# EAGLE design CrowPanel ESP32 Display-5.0-inch-V3.0-20240314  (EAGLE 9.6.2)
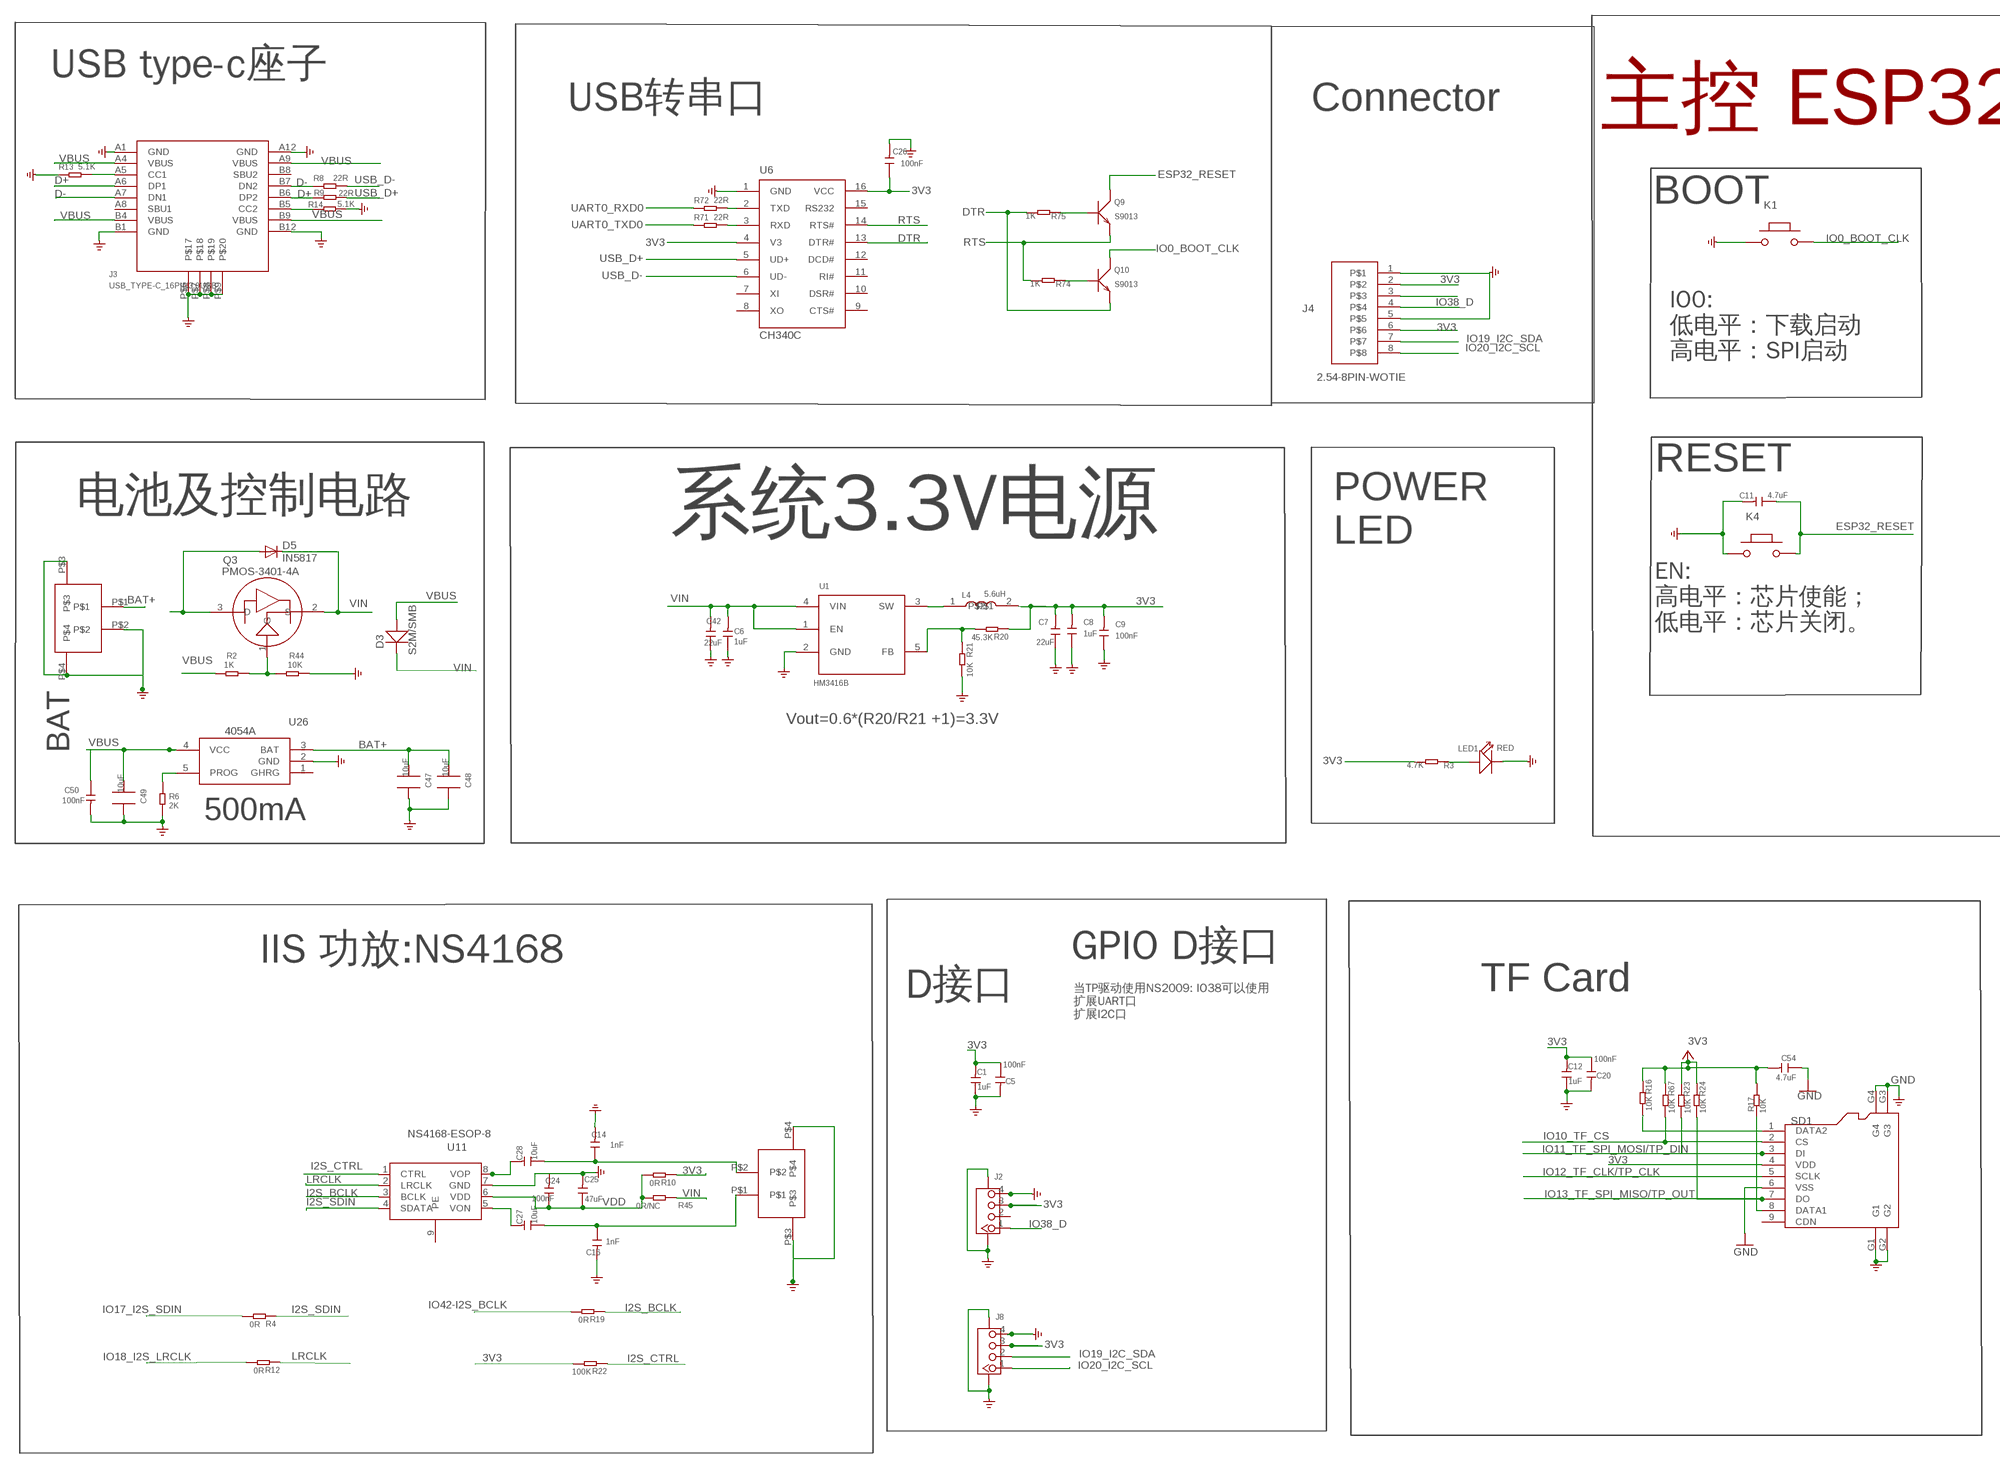
[diagram p0: schematic, sheet 1, part 1 of 2]
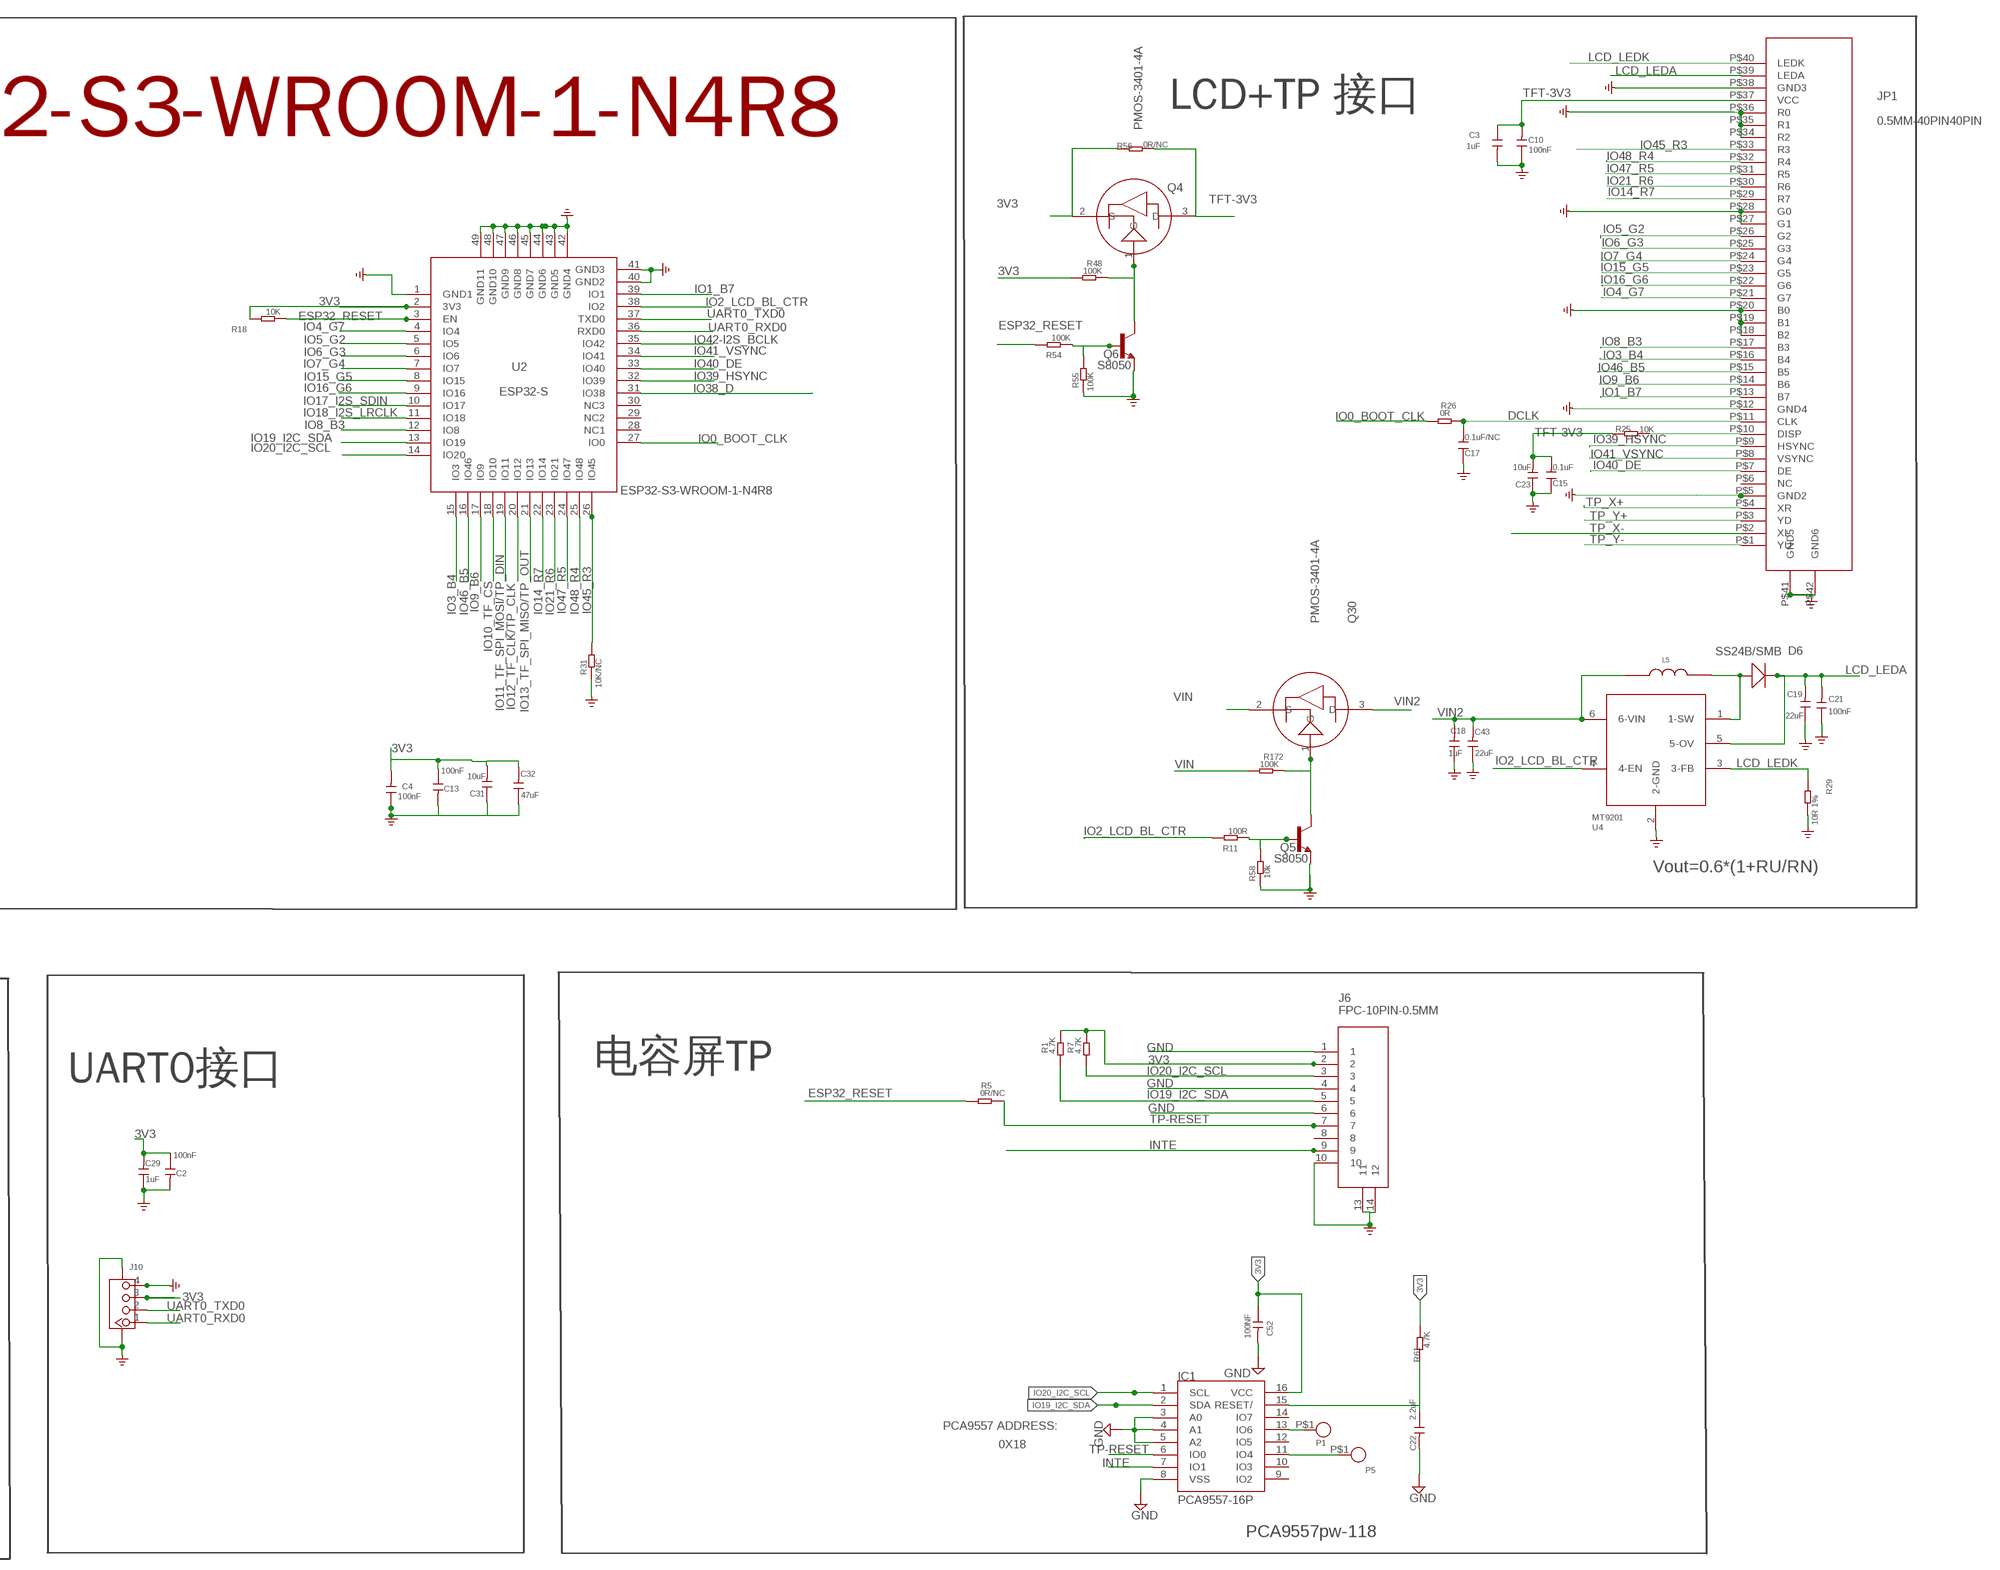
[diagram p1: schematic, sheet 1, part 2 of 2]

## Parts
C1  1uF  DISCRETE_C-0603  [DISCRETE_C0603]
C2  100nF  C-0603  [C0603]
C3  1uF  C-0603  [C0603]
C4  100nF  C-0603  [C0603]
C5  100nF  C-0603  [C0603]
C6  1uF  C0603  [0603]
C7  22uF  C0805  [0805]
C8  1uF  C0603  [0603]
C9  100nF  C0603  [0603]
C10  100nF  C-0603  [C0603]
C11  4.7uF  C0603  [0603]
C12  1uF  DISCRETE_C-0603  [DISCRETE_C0603]
C13  100nF  C-0603  [C0603]
C14  1nF  C-0603  [C0603]
C15  0.1uF  DISCRETE_C-0603  [DISCRETE_C0603]
C16  1nF  C-0603  [C0603]
C17  0.1uF/NC  DISCRETE_C-0603  [DISCRETE_C0603]
C18  1uF  C0603  [0603]
C19  22uF  C0805  [0805]
C20  100nF  C-0603  [C0603]
C21  100nF  C0603  [0603]
C22  2.2uF  C0603  [0603]
C23  10uF  DISCRETE_C-0603  [DISCRETE_C0603]
C24  100nF  C-0603  [C0603]
C25  47uF  C0805  [0805]
C26  100nF  C0603  [0603]
C27  10uF  DISCRETE_C-0603  [DISCRETE_C0603]
C28  10uF  DISCRETE_C-0603  [DISCRETE_C0603]
C29  1uF  DISCRETE_C-0603  [DISCRETE_C0603]
C31  10uF  DISCRETE_C-0603  [DISCRETE_C0603]
C32  47uF  C0805  [0805]
C42  22uF  C0805  [0805]
C43  22uF  C0805  [0805]
C47  10uF  C0805_S  [0805_S]
C48  10uF  C0805_S  [0805_S]
C49  10uF  C0805_S  [0805_S]
C50  100nF  C-0603  [C0603]
C52  100NF  A_XBJ_C0603  [A_XBJ_0603]
C54  4.7uF  DISCRETE_C-0603  [DISCRETE_C0603]
D3  S2M/SMB  214ABDO-214AB  [214AB]
D5  IN5817  DIODE-DO-214AC  [DO-214AC]
D6  SS24B/SMB  214ABDO-214AB  [214AB]
IC1  PCA9557-16P  [TSSOP16]
J1  PH2.0WT-2PIN  [PH2.0WT-2PIN]
J2  CONNECTOR_TWIG-4P-2.0-SMD-FEMALE-REINFORCE90D  [CONNECTOR_4P-SMD-2.0-90D]
J3  USB_TYPE-C_16PIN3.0USB  [KEVIN_3.0TYPEC-SMD]
J4  2.54-8PIN-WOTIE  [2.54-8P-WOTIE]
J5  PH2.0WT-2PIN  [PH2.0WT-2PIN]
J6  FPC-10PIN-0.5MM  [FPC-10PIN-0.5MM]
J8  CONNECTOR_TWIG-4P-2.0-SMD-FEMALE-REINFORCE90D  [CONNECTOR_4P-SMD-2.0-90D]
J10  CONNECTOR_TWIG-4P-2.0-SMD-FEMALE-REINFORCE90D  [CONNECTOR_4P-SMD-2.0-90D]
JP1  0.5MM-40PIN40PIN  [0.5MM*40P]
K1  BUTTON  PB157  [157SW]
K4  BUTTON  PB157  [157SW]
L4  5.6uH  L-0530  [CD54_CD54]
L5  CD32_6.8uH  CD32_950MA  [CD32]
LED1  RED  DISCRETE_LED0603  [DISCRETE_LED-0603]
P1  CROWPI_POW_PADPAD-1.0MM  [CROWPI_POW_PAD-1.0MM]
P5  CROWPI_POW_PADPAD-1.0MM  [CROWPI_POW_PAD-1.0MM]
Q3  PMOS-3401-4A  P-MOS-SOT23  [SOT-23]
Q4  PMOS-3401-4A  P-MOS-SOT23  [SOT-23]
Q5  S8050  SPARKFUN_TRANSISTOR_NPNSOT23  [SPARKFUN_SOT23]
Q6  S8050  SPARKFUN_TRANSISTOR_NPNSOT23  [SPARKFUN_SOT23]
Q9  S9013  TRANSISTOR-NPN-SOT23  [SOT23@1]
Q10  S9013  TRANSISTOR-NPN-SOT23  [SOT23@1]
Q30  PMOS-3401-4A  P-MOS-SOT23  [SOT-23]
R1  4.7K  R-0603  [R0603]
R2  1K  DISCRETE_R-0603  [DISCRETE_R0603]
R3  4.7K  DISCRETE_R-0603  [DISCRETE_R0603]
R4  0R  DISCRETE_R-0603  [DISCRETE_R0603]
R5  0R/NC  R-0603  [R0603]
R6  2K  DISCRETE_R-0603  [DISCRETE_R0603]
R7  4.7K  R-0603  [R0603]
R8  22R  DISCRETE_R-0603  [DISCRETE_R0603]
R9  22R  DISCRETE_R-0603  [DISCRETE_R0603]
R10  0R  DISCRETE_R-0603  [DISCRETE_R0603]
R11  100R  R0603  [R0603]
R12  0R  DISCRETE_R-0603  [DISCRETE_R0603]
R13  5.1K  DISCRETE_R-0603  [DISCRETE_R0603]
R14  5.1K  DISCRETE_R-0603  [DISCRETE_R0603]
R16  10K  DISCRETE_R-0603  [DISCRETE_R0603]
R17  10K  DISCRETE_R-0603  [DISCRETE_R0603]
R18  10K  DISCRETE_R-0603  [DISCRETE_R0603]
R19  0R  DISCRETE_R-0603  [DISCRETE_R0603]
R20  45.3K  DISCRETE_R-0603  [DISCRETE_R0603]
R21  10K  DISCRETE_R-0603  [DISCRETE_R0603]
R22  100K  DISCRETE_R-0603  [DISCRETE_R0603]
R23  10K  DISCRETE_R-0603  [DISCRETE_R0603]
R24  10K  DISCRETE_R-0603  [DISCRETE_R0603]
R25  10K  DISCRETE_R-0603  [DISCRETE_R0603]
R26  0R  R-0603  [R0603]
R29  10R 1%  DISCRETE_R-0603  [DISCRETE_R0603]
R31  10K/NC  R0603  [R0603]
R44  10K  DISCRETE_R-0603  [DISCRETE_R0603]
R45  0R/NC  DISCRETE_R-0603  [DISCRETE_R0603]
R48  100K  R-0603  [R0603]
R54  100K  R0603  [R0603]
R55  100K  R0603  [R0603]
R56  0R/NC  DISCRETE_R-0603  [DISCRETE_R0603]
R58  10k  R0603  [R0603]
R61  4.7K  DISCRETE_R-0603  [DISCRETE_R0603]
R67  10K  DISCRETE_R-0603  [DISCRETE_R0603]
R71  22R  DISCRETE_R-0603  [DISCRETE_R0603]
R72  22R  DISCRETE_R-0603  [DISCRETE_R0603]
R74  1K  DISCRETE_R-0603  [DISCRETE_R0603]
R75  1K  DISCRETE_R-0603  [DISCRETE_R0603]
R172  100K  R-0603  [R0603]
SD1  HOLDER-MICROSD-9P  [9P-SMD-W/-RING]
U1  HM3416B  A_XBJ_HM3420B  [A_XBJ_SOT23-5]
U2  ESP32-S  [ESP32-S3]
U4  MT9201  [SOT23-6]
U6  CH340C  CH340G  [SOP-16]
U11  NS4168-ESOP-8  [NS4168-ESOP-8]
U26  4054A  [SOP23-5]

## Nets
3V3: C1.2 C2.1 C4.2 C5.1 C7.2 C8.2 C9.2 C12.2 C13.1 C20.1 C26.1 C29.2 C31.2 C32.2 C52.1 C54.2 IC1.16(VCC) J2.3 J4.2 J4.6 J6.2 J8.3 J10.3 L4.2 Q4.2(S) R1.2 R3.2 R7.2 R10.1 R16.1 R17.1 R18.1 R20.1 R22.2 R23.1 R24.1 R48.1 R56.1 R61.2 R67.1 SD1.4(VDD) U2.2(3V3) U6.4(V3) U6.16(VCC) ; supply symbol labelled +3V3
BAT+: C47.2 C48.2 D5.A J1.P$1 Q3.3(D) U26.3(BAT)
D+: J3.A6(DP1) J3.B6(DP2) R9.1
D-: J3.A7(DN1) J3.B7(DN2) R8.1
DCLK: C17.2 JP1.P$11(CLK) R26.2
DTR: Q10.2(E) R75.2 U6.13(DTR#)
ESP32_RESET: C11.1 K4.2 Q9.3(C) R5.1 R18.2 R54.2 U2.3(EN)
GND: C1.1 C2.2 C3.2 C4.1 C5.2 C6.1 C7.1 C8.1 C9.1 C10.1 C11.2 C12.1 C13.2 C14.2 C15.1 C16.2 C17.1 C18.1 C19.1 C20.2 C21.1 C22.2 C23.1 C24.2 C25.2 C26.2 C29.1 C31.1 C32.1 C42.1 C43.1 C47.1 C48.1 C49.1 C50.2 C52.2 C54.1 IC1.3(A0) IC1.4(A1) IC1.5(A2) IC1.8(VSS) J1.P$2 J1.P$3 J1.P$4 J2.4 J2.SS1 J2.SS2 J3.A1(GND) J3.A12(GND) J3.B1(GND) J3.B12(GND) J3.P$6 J3.P$7 J3.P$8 J3.P$9 J4.1 J4.5 J5.P$3 J5.P$4 J6.1 J6.4 J6.6 J6.10 J6.13 J6.14 J8.4 J8.SS1 J8.SS2 J10.4 J10.SS1 J10.SS2 JP1.P$5(GND2) JP1.P$12(GND4) JP1.P$18(B2) JP1.P$19(B1) JP1.P$20(B0) JP1.P$27(G1) JP1.P$28(G0) JP1.P$34(R2) JP1.P$35(R1) JP1.P$36(R0) JP1.P$38(GND3) JP1.P$41(GND5) JP1.P$42(GND6) K1.1 K4.1 LED1.- Q5.2(E) Q6.2(E) R6.2 R13.1 R14.2 R21.2 R29.2 R31.1 R44.1 R55.1 R58.1 SD1.6(VSS) SD1.G1 SD1.G2 SD1.G3 SD1.G4 U1.2(GND) U2.1(GND1) U2.40(GND2) U2.41(GND3) U2.42(GND4) U2.43(GND5) U2.44(GND6) U2.45(GND7) U2.46(GND8) U2.47(GND9) U2.48(GND10) U2.49(GND11) U4.2(2-GND) U6.1(GND) U11.7(GND) U26.2(GND)
I2S_BCLK: R19.1 U11.3(BCLK)
I2S_CTRL: R22.1 U11.1(CTRL)
I2S_SDIN: R4.1 U11.4(SDATA)
INTE: IC1.7(IO1) J6.9
IO0_BOOT_CLK: K1.2 Q10.3(C) R26.1 U2.27(IO0)
IO1_B7: JP1.P$13(B7) U2.39(IO1)
IO2_LCD_BL_CTR: R11.2 U2.38(IO2) U4.4(4-EN)
IO3_B4: JP1.P$16(B4) U2.15(IO3)
IO4_G7: JP1.P$21(G7) U2.4(IO4)
IO5_G2: JP1.P$26(G2) U2.5(IO5)
IO6_G3: JP1.P$25(G3) U2.6(IO6)
IO7_G4: JP1.P$24(G4) U2.7(IO7)
IO8_B3: JP1.P$17(B3) U2.12(IO8)
IO9_B6: JP1.P$14(B6) U2.17(IO9)
IO10_TF_CS: R67.2 SD1.2(CS) U2.18(IO10)
IO11_TF_SPI_MOSI/TP_DIN: R23.2 SD1.3(DI) U2.19(IO11)
IO12_TF_CLK/TP_CLK: SD1.5(SCLK) U2.20(IO12)
IO13_TF_SPI_MISO/TP_OUT: R24.2 SD1.7(DO) U2.21(IO13)
IO14_R7: JP1.P$29(R7) U2.22(IO14)
IO15_G5: JP1.P$23(G5) U2.8(IO15)
IO16_G6: JP1.P$22(G6) U2.9(IO16)
IO17_I2S_SDIN: R4.2 U2.10(IO17)
IO18_I2S_LRCLK: R12.2 U2.11(IO18)
IO19_I2C_SDA: IC1.2(SDA) J4.7 J6.5 J8.2 R1.1 U2.13(IO19)
IO20_I2C_SCL: IC1.1(SCL) J4.8 J6.3 J8.1 R7.1 U2.14(IO20)
IO21_R6: JP1.P$30(R6) U2.23(IO21)
IO38_D: J2.1 J4.4 U2.31(IO38)
IO39_HSYNC: JP1.P$9(HSYNC) U2.32(IO39)
IO40_DE: JP1.P$7(DE) U2.33(IO40)
IO41_VSYNC: JP1.P$8(VSYNC) U2.34(IO41)
IO42-I2S_BCLK: R19.2 U2.35(IO42)
IO45_R3: JP1.P$33(R3) R31.2 U2.26(IO45)
IO46_B5: JP1.P$15(B5) U2.16(IO46)
IO47_R5: JP1.P$31(R5) U2.24(IO47)
IO48_R4: JP1.P$32(R4) U2.25(IO48)
LCD_LEDA: C19.2 C21.2 D6.2(-) JP1.P$39(LEDA) U4.5(5-OV)
LCD_LEDK: JP1.P$40(LEDK) R29.1 U4.3(3-FB)
LRCLK: R12.1 U11.2(LRCLK)
N$1: LED1.+ R3.1
N$2: C27.2 U11.5(VON)
N$3: C14.1 C28.1 J5.P$2
N$7: JP1.P$10(DISP) R25.2
N$8: C28.2 U11.8(VOP)
N$11: J3.A5(CC1) R13.2
N$13: L4.1 U1.3(SW)
N$15: C16.1 C27.1 J5.P$1
N$16: D6.1(+) L5.2 U4.1(1-SW)
N$17: J3.B5(CC2) R14.1
N$20: R20.2 R21.1 U1.5(FB)
N$21: Q3.1(G) R2.1 R44.2
N$22: R6.1 U26.5(PROG)
N$23: Q5.1(B) R11.1 R58.2
N$27: Q4.1(G) Q6.3(C) R48.2
N$28: J4.3
N$32: Q9.1(B) R75.1
N$33: Q6.1(B) R54.1 R55.2
N$36: Q5.3(C) Q30.1(G) R172.2
N$38: Q10.1(B) R74.1
N$40: R72.2 U6.2(TXD)
N$41: IC1.13(IO6) P1.P$1
N$42: R71.2 U6.3(RXD)
N$43: IC1.11(IO4) P5.P$1
N$47: R16.2 SD1.1(DATA2)
N$48: R17.2 SD1.8(DATA1)
N$66: C22.1 IC1.15(RESET/) R61.1
RTS: Q9.2(E) R74.2 U6.14(RTS#)
TFT-3V3: C3.1 C10.2 C15.2 C23.2 JP1.P$37(VCC) Q4.3(D) R25.1 R56.2
TP-RESET: IC1.6(IO0) J6.7 R5.2
TP_X+: JP1.P$4(XR)
TP_X-: JP1.P$2(XL)
TP_Y+: JP1.P$3(YD)
TP_Y-: JP1.P$1(YU)
UART0_RXD0: J10.1 R72.1 U2.36(RXD0)
UART0_TXD0: J10.2 R71.1 U2.37(TXD0)
USB_D+: R9.2 U6.5(UD+)
USB_D-: R8.2 U6.6(UD-)
VBUS: C49.2 C50.1 D3.1(+) J3.A4(VBUS) J3.A9(VBUS) J3.B4(VBUS) J3.B9(VBUS) R2.2 U26.4(VCC)
VDD: C24.1 C25.1 R10.2 R45.2 U11.6(VDD)
VIN: C6.2 C42.2 D3.2(-) D5.C Q3.2(S) Q30.2(S) R45.1 R172.1 U1.1(EN) U1.4(VIN)
VIN2: C18.2 C43.2 L5.1 Q30.3(D) U4.6(6-VIN)
Unconnected: IC1.9(IO2) IC1.10(IO3) IC1.12(IO5) IC1.14(IO7) J2.2 J3.A8(SBU1) J3.B8(SBU2) J6.8 JP1.P$6(NC) SD1.9(CDN) U2.28(NC1) U2.29(NC2) U2.30(NC3) U6.7(XI) U6.8(XO) U6.9(CTS#) U6.10(DSR#) U6.11(RI#) U6.12(DCD#) U6.15(RS232) U11.9(PE) U26.1(GHRG)

## Notes on the sheet
- USB type-c座子
- USB转串口 | Connector | LCD+TP 接口
- 主控 ESP32-S3-WROOM-1-N4R8
- BOOT
- IO0:
  低电平：下载启动
  高电平：SPI启动
- RESET
- 电池及控制电路
- 系统3.3V电源
- POWER
  LED
- EN:
  高电平：芯片使能；
  低电平：芯片关闭。
- Vout=0.6*(R20/R21 +1)=3.3V
- BAT
- Vout=0.6*(1+RU/RN)
- 500mA
- IIS 功放:NS4168 | GPIO D接口
- TF Card | UART0接口 | 电容屏TP
- D接口
- 当TP驱动使用NS2009: IO38可以使用
  扩展UART口
  扩展I2C口
- PCA9557 ADDRESS:
- 0X18
- PCA9557pw-118

## Library data of the parts
C1 C12 C27-C29 = A_xbj:DISCRETE_C*: Ceramic Capacitors
C2-C5 C10 C13 C14 C16 C20 C24 C50 = discrete:C*: Ceramic Capacitors
C6 C8 C9 C11 C18 C21 C22 C26 = A_xbj:C0603
C7 C19 C25 C32 C42 C43 = A_xbj:C0805
C15 C17 C23 C31 C54 = A9G:DISCRETE_C*: Ceramic Capacitors
C47-C49 = CPT_SMD:C0805
C52 = CrowBot_V1.4:A_XBJ_C0603
D3 D6 = DO-214AB:214AB: 214AB
D5 = diode:DIODE-: DIODE
IC1 = Lora_RA-08H_Dev:PCA9557-16P
J1 J5 = cooper:PH2.0WT-2PIN
J2 J8 J10 = A_xbj:CONNECTOR_TWIG-4P-2.0-SMD-FEMALE-REINFORCE
J3 = WZ3532R024-ESP32-V0.1-20221226:USB_TYPE-C_16PIN
J4 = cooper:2.54-8PIN-WOTIE
J6 = cooper:FPC-10PIN-0.5MM
JP1 = cooper:0.5MM-40PIN
K1 K4 = MySMD:PB157
L4 = WZ2432R028-ESP32-V1.2-20231108:L-0530
L5 = CD54:CD32_950MA
LED1 = A_xbj:DISCRETE_LED*
P1 P5 = CrowBot_V1.4:CROWPI_POW_PAD*
Q3 Q4 Q30 = DFN8:P-MOS-SOT23
Q5 Q6 = Adafruit_HUZZAH32_ESP32_Feather:SPARKFUN_TRANSISTOR_NPN: Transistor NPN BJT configuration in SOT23 package. MMBT2222 is the common NPN we use. Double check BCE configuration again layout.
Q9 Q10 = discrete:TRANSISTOR-NPN*: NPN audion
R1 R5 R7 R26 R48 R172 = discrete:R*
R2 R6 R44 = A9G:DISCRETE_R*
R3 R4 R8-R10 R12-R14 R16-R25 R29 R45 R56 R67 R71 R72 R74 R75 = Crowtail-_LED-V2.0-20190615-01:DISCRETE_R*
R11 R31 R54 R55 R58 = cooper:R0603
R61 = Lora_RA-08H_Dev:DISCRETE_R*
SD1 = Connector:HOLDER-MICROSD-9P
U1 = CrowBot_-V1.0-20220525:A_XBJ_HM3420B
U2 = DW1000:ESP32-S; U2: ESP32-S3-WROOM-1-N4R8
U4 = cooper:MT9201
U6 = A_xbj:CH340G
U11 = STC_MCUSTC8G1K08A:NS4168-ESOP-8
U26 = DFN8:4054A

## Net classes
0 default: width 0.152 mm, drill 0.305 mm, clearance 0.203 mm

## Board
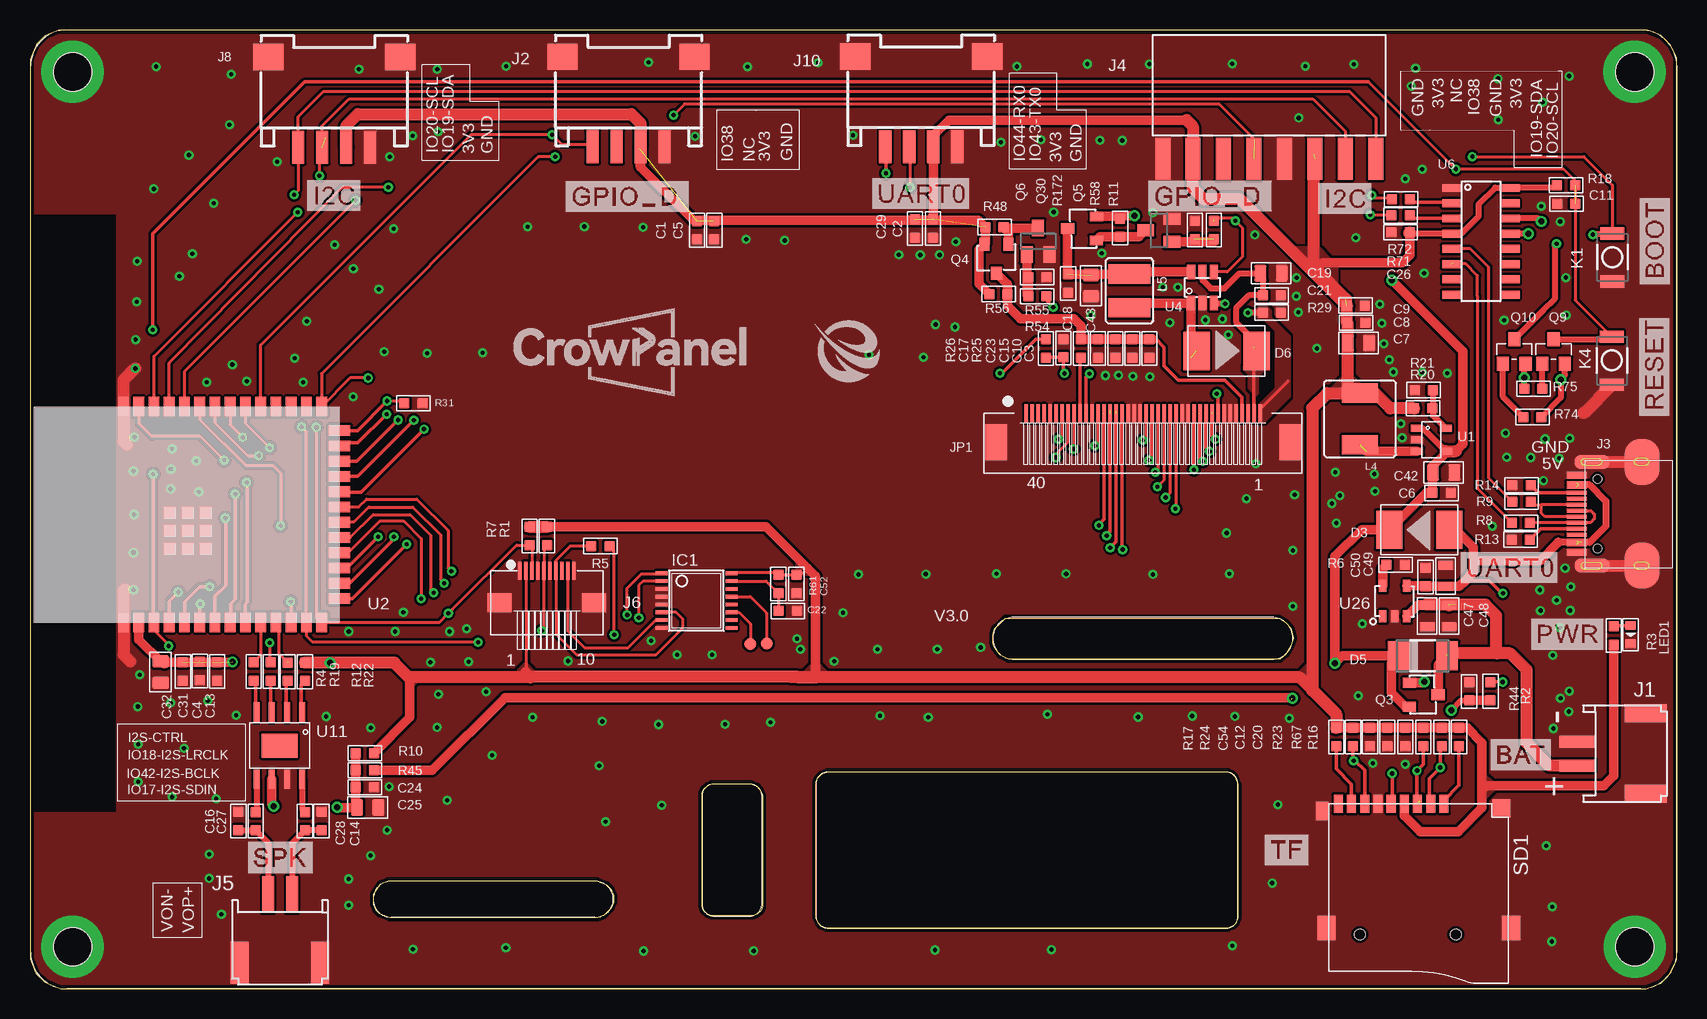
[diagram p2: board, top side]
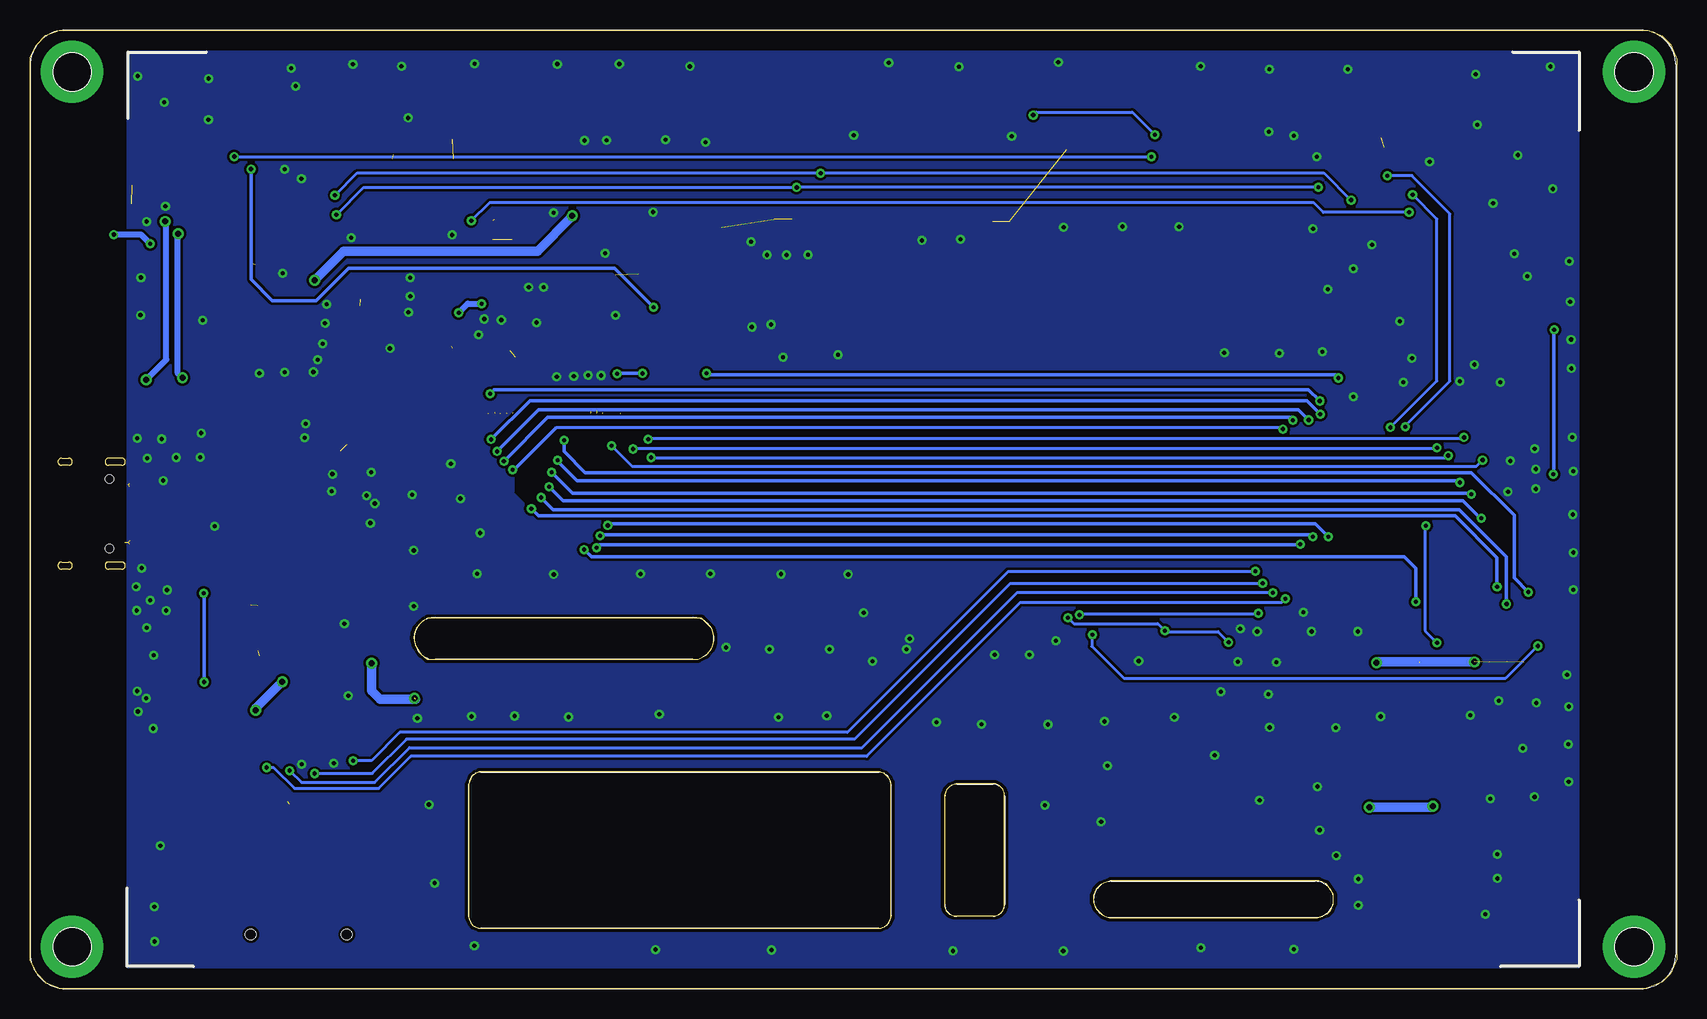
[diagram p3: board, bottom side, seen from below]

Size 137.27 x 79.91 mm. Coordinates in mm from the lower left corner, seen from the top.
Outline: 104.17,27.48 81.58,27.48 80.9,27.8 80.82,27.89 80.48,28.35 80.37,28.51 80.27,28.87 80.27,29.47 80.4,30 80.85,30.45 81.3,30.89 104.1,30.89 104.42,30.73 104.67,30.52 105.09,30.05 105.25,29.6 105.3,29.2 105.12,28.6 104.68,27.88 104.17,27.48
Outline: 134.84,79.91 2.39,79.91 1.26,79.44 0.52,78.7 0,77.45 0,2.48 0.48,1.32 1.26,0.54 2.57,0 134.74,0 135.92,0.49 136.72,1.29 137.27,2.41 137.27,77.6 136.76,78.64 135.94,79.45 134.84,79.91
Outline: 100.71,17.05 100.71,5.94 100.51,5.45 100.32,5.27 99.83,5.07 66.39,5.07 65.9,5.27 65.72,5.45 65.51,5.94 65.51,17.21 65.66,17.56 65.98,17.89 66.47,18.09 99.83,18.09 100.18,17.95 100.45,17.68 100.71,17.05
Outline: 61.06,16.12 61.06,6.87 60.92,6.52 60.62,6.22 60.27,6.08 56.81,6.08 56.47,6.22 56.16,6.52 56.02,6.87 56.02,16.29 56.16,16.64 56.47,16.94 56.81,17.08 60.1,17.08 60.59,16.88 60.86,16.61 61.06,16.12
Outline: 48.63,7.81 48.63,7.2 48.43,6.71 47.85,6.14 47.3,5.91 29.97,5.91 29.13,6.25 28.84,6.55 28.64,7.04 28.64,7.88 29.22,8.76 29.85,9.02 47.21,9.02 48.05,8.67 48.43,8.3 48.63,7.81
Copper layers (1*16): Top 0.035mm / dielectric 1.5mm / Bottom 0.035mm
Design rules "default *": minimum track width 6mil, minimum drill 0.35mm, track to track 8mil, track to pad 7mil, pad to pad 7mil, via to via 8mil, smd to smd 10mil, copper to edge 10mil, drill to drill 8mil, minimum pad ring 10mil, minimum via ring 8mil, stop-mask expansion 4mil, vias tented up to drill 100mil, thermal gap 0mil

### Footprints (pad centres in the part's own frame; a part is rotated, then mirrored left to right if it is on the bottom)
DISCRETE_C0603 = smd 0.889 x 0.889: 1 -0.762,0; 2 0.762,0
C0603 = smd 0.889 x 0.889: 1 -0.762,0; 2 0.762,0
0603 = smd 0.889 x 0.889: 1 -0.762,0; 2 0.762,0
0805 = smd 1.016 x 1.397: 1 -0.889,0; 2 0.889,0
0805_S = smd 0.762 x 1.27: 1 -0.889,0; 2 0.889,0
A_XBJ_0603 = smd 0.889 x 0.889: 1 -0.762,0; 2 0.762,0
214AB = smd 2.2 x 3.2: 1 -2.5,0; 2 2.5,0
DO-214AC = smd 1.8 x 2.4: A 2.025,0; C -2.025,0
TSSOP16 = smd 0.305 x 0.991: 1 -2.275,-2.918; 2 -1.625,-2.918; 3 -0.975,-2.918; 4 -0.325,-2.918; 5 0.325,-2.918; 6 0.975,-2.918; 7 1.625,-2.918; 8 2.275,-2.918; 9 2.275,2.918; 10 1.625,2.918; 11 0.975,2.918; 12 0.325,2.918; 13 -0.325,2.918; 14 -0.975,2.918; 15 -1.625,2.918; 16 -2.275,2.918
PH2.0WT-2PIN = smd 1 x 3: P$1 -1,0; P$2 1,0 | smd 1.5 x 3.5: P$3 -3.35,-5.7; P$4 3.35,-5.7
CONNECTOR_4P-SMD-2.0-90D = smd 1.01 x 2.74: 1 -3,-0.1; 2 -1,-0.1; 3 1,-0.1; 4 3,-0.1 | smd 2.54 x 2.184: SS1 -5.5,7.4; SS2 5.5,7.4
KEVIN_3.0TYPEC-SMD = smd 0.3 x 1.7: A1 -3.35,0.5; A4 -2.55,0.5; A5 -1.25,0.5; A6 -0.25,0.5; A7 0.25,0.5; A8 1.25,0.5; A9 2.55,0.5; A12 3.35,0.5; B1 3.05,0.5; B4 2.25,0.5; B5 1.75,0.5; B6 0.75,0.5; B7 -0.75,0.5; B8 -1.75,0.5; B9 -2.25,0.5; B12 -3.05,0.5 | smd 1.143 x 2.921: P$6 -4.318,-0.762; P$7 4.318,-0.762 | smd 3.81 x 2.921: P$8 -4.318,-4.953; P$9 4.318,-4.953 | hole 0.68: -2.89,-1.22; 2.89,-1.22
2.54-8P-WOTIE = smd 1.25 x 3.5: 1 -8.839,-4.572; 2 -6.35,-4.572; 3 -3.81,-4.572; 4 -1.27,-4.572; 5 1.27,-4.572; 6 3.81,-4.572; 7 6.35,-4.572; 8 8.89,-4.572
FPC-10PIN-0.5MM = smd 0.3 x 1.5: 1 -2.25,2.54; 2 -1.75,2.54; 3 -1.25,2.54; 4 -0.75,2.54; 5 -0.25,2.54; 6 0.25,2.54; 7 0.75,2.54; 8 1.25,2.54; 9 1.75,2.54; 10 2.25,2.54 | smd 2 x 1.6: 13 -3.95,-0.14; 14 3.95,-0.14
0.5MM*40P = smd 0.3 x 1.5: P$1 -8.81,1.73; P$2 -8.31,1.73; P$3 -7.81,1.73; P$4 -7.31,1.73; P$5 -6.81,1.73; P$6 -6.31,1.73; P$7 -5.81,1.73; P$8 -5.31,1.73; P$9 -4.81,1.73; P$10 -4.31,1.73; P$11 -3.81,1.73; P$12 -3.31,1.73; P$13 -2.81,1.73; P$14 -2.31,1.73; P$15 -1.81,1.73; P$16 -1.31,1.73; P$17 -0.81,1.73; P$18 -0.31,1.73; P$19 0.19,1.73; P$20 0.69,1.73; P$21 1.19,1.73; P$22 1.69,1.73; P$23 2.19,1.73; P$24 2.69,1.73; P$25 3.19,1.73; P$26 3.69,1.73; P$27 4.19,1.73; P$28 4.69,1.73; P$29 5.19,1.73; P$30 5.69,1.73; P$31 6.19,1.73; P$32 6.69,1.73; P$33 7.19,1.73; P$34 7.69,1.73; P$35 8.19,1.73; P$36 8.69,1.73; P$37 9.19,1.73; P$38 9.69,1.73; P$39 10.19,1.73; P$40 10.69,1.73 | smd 1.8 x 3: P$41 -11.31,-0.67; P$42 13.19,-0.67
157SW = smd 1.016 x 1.981: 1 0,0; 2 4,0
CD54_CD54 = smd 3 x 1.6: 1 0,2.159; 2 0,-2.159
CD32 = smd 3.5 x 1.6: 1 0,1.409; 2 0,-1.409
DISCRETE_LED-0603 = smd 0.762 x 0.889: + -0.762,0; - 0.762,0
CROWPI_POW_PAD-1.0MM = smd 1 x 1: P$1 0,0
SOT-23 = smd 1.1 x 0.8: 1 1.2,-1; 2 1.2,1 | smd 1.1 x 0.9: 3 -1.2,0
SPARKFUN_SOT23 = smd 1 x 1.4: 1 -0.95,-1.1; 2 0.95,-1.1; 3 0,1.1
SOT23@1 = smd 1.016 x 1.143: 1 -0.95,-1.016; 2 0.95,-1.016; 3 0,1.016
R0603 = smd 0.889 x 0.889: 1 -0.762,0; 2 0.762,0
DISCRETE_R0603 = smd 0.889 x 0.889: 1 -0.762,0; 2 0.762,0
9P-SMD-W/-RING = smd 1.524 x 0.762: 1 0,4.4; 2 0,3.3; 3 0,2.2; 4 0,1.1; 5 0,0; 6 0,-1.1; 7 0,-2.2; 8 0,-3.3; 9 0,-4.4 | smd 1.524 x 1.016: G1 0.6,-5.746 | smd 2.032 x 1.524: G2 10.373,-5.4; G3 10.373,10 | smd 1.524 x 1.524: G4 0.392,9.181 | hole 0.889: 10.9,-2.6; 10.9,5.4
A_XBJ_SOT23-5 = smd 0.6 x 1: 1 -0.95,-1.2; 2 0,-1.2; 3 0.95,-1.2; 4 0.95,1.2; 5 -0.95,1.2
ESP32-S3 = smd 1.6 x 0.9: 1 0,18.01; 2 0,16.74; 3 0,15.47; 4 0,14.2; 5 0,12.93; 6 0,11.66; 7 0,10.39; 8 0,9.12; 9 0,7.85; 10 0,6.58; 11 0,5.31; 12 0,4.04; 13 0,2.77; 14 0,1.5; 27 18,1.5; 28 18,2.77; 29 18,4.04; 30 18,5.31; 31 18,6.58; 32 18,7.85; 33 18,9.12; 34 18,10.39; 35 18,11.66; 36 18,12.93; 37 18,14.2; 38 18,15.47; 39 18,16.74; 40 18,18.01 | smd 0.9 x 1.8: 15 2,0; 16 3.28,0; 17 4.55,0; 18 5.82,0; 19 7.09,0; 20 8.36,0; 21 9.63,0; 22 10.9,0; 23 12.17,0; 24 13.44,0; 25 14.71,0; 26 16,0 | smd 1 x 1: 41 7.64,11.16; 42 9.14,11.16; 43 6.14,11.16; 44 6.14,14.16; 45 7.64,12.66; 46 9.14,12.66; 47 7.64,14.16; 48 9.14,14.16; 49 6.14,12.66
SOT23-6 = smd 0.69 x 1.2: 1 -0.95,-1.3; 2 0,-1.3; 3 0.95,-1.3; 4 0.95,1.3; 5 0,1.3; 6 -0.95,1.3
SOP-16 = smd 0.66 x 1.5: 1 -4.445,-2.475; 2 -3.175,-2.475; 3 -1.905,-2.475; 4 -0.635,-2.475; 5 0.635,-2.475; 6 1.905,-2.475; 7 3.175,-2.475; 8 4.445,-2.475; 9 4.445,2.475; 10 3.175,2.475; 11 1.905,2.475; 12 0.635,2.475; 13 -0.635,2.475; 14 -1.905,2.475; 15 -3.175,2.475; 16 -4.445,2.475
NS4168-ESOP-8 = smd 1.6 x 0.5: 1 -2.8,1.905; 2 -2.8,0.635; 3 -2.8,-0.635; 4 -2.8,-1.905; 5 2.8,-1.905; 6 2.8,-0.635; 7 2.8,0.635; 8 2.8,1.905 | smd 2 x 3: 9 0,0
SOP23-5 = smd 1 x 0.635: 1 -1.27,1; 2 -1.27,0; 3 -1.27,-1; 4 1.27,-1; 5 1.27,1

### Placement (x,y rotation side)
C1  55.61,63.22 90 top
C2  75.26,63.36 270 top
C3  93.32,53.37 270 top
C4  14.17,26.48 90 top
C5  57.04,63.22 270 top
C6  117.67,41.33 180 top
C7  110.74,53.82 180 top
C8  110.54,55.51 180 top
C9  110.52,56.94 180 top
C10  91.9,53.37 90 top
C11  128.07,65.42 180 top
C12  113.15,20.99 90 top
C13  15.61,26.44 270 top
C14  24.29,13.99 90 top
C15  90.47,53.37 90 top
C16  17.37,13.99 90 top
C17  86.15,53.4 270 top
C18  86.54,58.78 90 top
C19  103.45,59.63 180 top
C20  114.65,20.99 270 top
C21  103.52,57.79 180 top
C22  63.17,31.5 0 top
C23  89.03,53.37 90 top
C24  27.91,16.8 0 top
C25  28.15,15.11 0 top
C26  114.26,63.05 180 top
C27  18.81,13.97 90 top
C28  22.92,13.97 90 top
C29  73.76,63.36 90 top
C31  12.74,26.45 90 top
C32  10.89,26.4 90 top
C42  117.84,43.03 180 top
C43  88.44,58.6 90 top
C47  116.46,31.08 90 top
C48  118.29,31.07 90 top
C49  118.01,34.42 270 top
C50  116.33,34.32 90 top
C52  63.88,33.73 270 top
C54  111.71,20.99 90 top
D3  115.81,38.26 180 top
D5  116.1,27.75 0 top
D6  99.74,53.16 0 top
IC1  55.55,32.36 270 top
J1  128.97,19.61 90 top
J2  49.9,70.28 0 top
J3  129.44,39.6 90 top
J4  103.29,73.77 0 top
J5  20.83,7.88 0 top
J6  43.08,32.31 0 top
J8  25.36,70.25 0 top
J10  74.29,70.29 0 top
JP1  91.84,46.23 0 top
K1  131.9,58.95 90 top
K4  131.86,50.34 90 top
L4  110.87,47.5 180 top
L5  91.67,58.17 0 top
LED1  133.43,29.52 270 top
P1  61.42,28.8 0 top
P5  60.05,28.73 270 top
Q3  116.18,24.51 180 top
Q4  80.56,60.85 90 top
Q5  94.1,63.22 90 top
Q6  84.04,62.3 0 top
Q9  127,53.12 0 top
Q10  123.72,53.12 0 top
Q30  87.7,63.37 0 top
R1  43.08,37.74 90 top
R2  121.74,24.8 90 top
R3  132.03,29.46 270 top
R4  18.66,26.45 90 top
R5  47.54,36.9 180 top
R6  113.84,35.36 0 top
R7  41.66,37.74 90 top
R8  124.27,38.85 180 top
R9  124.32,40.59 180 top
R10  27.91,19.64 180 top
R11  98.69,63.24 90 top
R12  21.47,26.43 90 top
R13  124.27,37.45 0 top
R14  124.33,41.98 180 top
R16  119.12,20.99 270 top
R17  108.89,20.99 270 top
R18  128.05,66.96 0 top
R19  20.08,26.45 90 top
R20  116.12,48.38 0 top
R21  116.18,49.9 180 top
R22  22.92,26.43 90 top
R23  116.15,20.99 270 top
R24  110.28,20.99 270 top
R25  87.6,53.37 270 top
R26  84.68,53.37 270 top
R29  103.52,56.36 0 top
R31  31.97,48.8 180 top
R44  119.96,24.8 270 top
R45  27.91,18.22 180 top
R48  80.4,63.48 0 top
R54  83.97,57.72 0 top
R55  83.98,59.32 180 top
R56  80.73,57.91 0 top
R58  97.09,63.24 270 top
R61  62.38,33.73 90 top
R67  117.68,20.99 270 top
R71  114.25,64.45 0 top
R72  114.28,65.8 0 top
R74  125.24,47.66 0 top
R75  125.32,50.01 180 top
R172  90.87,63.42 270 top
SD1  113.46,15.44 270 top
U1  116.81,45.76 270 top
U2  25.81,30.53 90 top
U4  97.74,58.45 0 top
U6  120.95,62.3 270 top
U11  20.8,20.27 270 top
U26  113.76,32.32 90 top
U$30  [ELECROW-NEW]  65.39,50.56 0 top
U$32  [LOGE-2.0]  39.52,48.67 0 top
U$33  [5.0底框]  138.34,-0.06 0 bottom
U$41  [5.0板框]  -0.6,0.03 0 top

### Tracks (layer width: path | path; a pad name or v marks a point on that pad's centre or on a via)
0
  cutout Bottom: 93.15,46.48 96.51,46.48 96.76,46.23 96.76,41.36 95.08,39.68 95.08,41.78 93.06,43.79 93.06,46.4
3V3  (via drill 0.5)  (9 unrouted)
  Top 0.203: 109.65,56.95 C9.2 109.53,56.83 | C8.2 109.55,55.54
  Top 0.254: J6.2 41.33,26.31 41.33,25.97 41.4,25.9 | IC1.16 58.49,34.66 62.22,34.66 R61.2 C52.1 64.24,34.49 64.8,35.06
  Top 0.5: U6.16 123.45,66.77 | C26.1 115.13,62.93 U6.4 119.32,62.93 120.75,64.36 120.75,65.37 122.15,66.77 123.45,66.77 | R18.1 127.09,66.77 123.45,66.77
  Top 0.8: C32.2 9.07,29.12 U2.2 | SD1.4 114.56,14.45 115.9,13.11 119.04,13.11 121.04,15.1 121.04,16.58 | 50.85,69.96 50.85,68.53 50.9,68.48 | J10.3 75.32,70.23 | 75.32,70.23 75.32,64.18 C2.1 | 96.42,72.4 76.6,72.4 75.32,71.12 75.32,70.23 | 50.9,68.48 55.32,64.06 79.06,64.06 R48.1 79.64,62.13 Q4.2 79.1,61.59 79.1,58.77 R56.1 | 50.9,68.48 J2.3 | R17.1 R24.1 C54.2 C12.2 C20.1 R23.1 R67.1 R16.1 119.81,21.75 121.04,20.52 121.04,16.58 | R1.2 43.67,38.51 43.68,38.5 61.37,38.5 64.8,35.06 65.49,34.38 65.49,25.95 | 64.01,26 64.06,25.95 | v16.88,27.24 16.84,27.21 11.23,27.21 | 31.66,25.9 31.66,22.63 R10.1 | 121.04,16.58 121.4,16.94 131.19,16.94 132.03,17.78 R3.2 | 107.22,59.96 107.77,60.51 114.4,60.51 115.02,61.13 C26.1
  Top 1: 11.23,27.21 11.14,27.29 C32.2 | 114.97,63 C26.1 | R22.2 v25.02,27.19 30.37,27.19 31.66,25.9 31.71,25.95 41.7,25.95 41.65,26 | R7.2 R1.2 | 109.71,57.47 107.22,59.96 107.01,60.17 107.01,69.52 | 110.37,49.66 109.85,50.18 C7.2 109.85,55.44 C8.2 109.78,56.92 C9.2 100.91,65.79 97.87,65.79 96.94,66.72 J4.2 96.94,71.88 96.42,72.4 | J8.3 26.36,71.93 27.33,72.9 50.14,72.9 50.9,72.14 J2.3 | 65.49,25.95 105.85,25.95 108.89,22.91 R17.1 108.89,22.87 106.88,24.87 106.88,48.41 108.13,49.66 110.37,49.66 | 63.42,26 64.01,26 65.44,26 | 63.42,26 41.65,26 | 41.65,26 41.33,26.31 | 110.37,49.66 L4.2 | R20.1 113.39,48.38 112.07,49.71 110.42,49.71 110.37,49.66 | 65.44,26 65.49,25.95 | 63.42,26 65.44,26 | 65.44,26 65.49,25.95 | 64.06,25.95 65.49,25.95
  Bottom 0.8: v25.02,27.19 24.97,27.24 v16.88,27.24 | v16.88,27.24
  pour Top (no thermals): 107.09,60.26 109.02,60.26 109.02,58.24 107.09,60.17
  pour Top (no thermals): 106.67,27.33 105.41,26.07 106.84,24.64 106.84,27.41 106.76,27.41
  pour Top (no thermals): 31.49,24.72 32.42,25.65 31.49,26.57
  pour Top (no thermals): 121.12,15.57 122.38,16.83 120.95,18.26 120.95,15.48 121.04,15.48
  pour Top (no thermals): 66.83,26.08 65.49,27.42 64.06,25.99 66.83,25.99
  pour Top (no thermals): 42.58,25.98 41.32,27.24 39.89,25.82 42.66,25.82 42.66,25.9
  pour Top (no thermals): 111.12,50.26 109.86,51.52 108.44,50.09 111.21,50.09 111.21,50.18
  pour Top (no thermals): 105.09,61.91 107.02,61.91 107.02,59.89 105.09,61.82
  pour Top (no thermals): 108.91,60.32 106.98,60.32 106.98,62.33 108.91,60.4
  pour Top (no thermals): 65.16,34.53 64.71,34.98 64.21,34.48 65.16,34.48
  pour Top (no thermals): 63.9,34.51 64.52,35.13 63.82,35.83 63.82,34.51
BAT+  (2 unrouted)
  Top 0.8: C48.2 118.3,31.96 | C47.2 115.68,31.97 U26.3 115.72,32.01 116.43,32.01 | 118.87,32.01 118.29,32.01 | Q3.3 117.38,27.01 D5.A
  Top 1: J1.P$1 126.65,18.61 124.75,20.5 124.75,26.6 123.39,27.97 122.3,27.97 | 122.3,27.97 118.26,27.97 118.26,28.17 | 122.3,27.97 122.23,28.04 122.23,31.11 121.33,32.01 118.29,32.01 | C48.2 118.24,32.01 116.43,32.01
D+
  Top 0.254: J3.A6 126.29,39.35 125.98,39.65 125.98,40.3 | J3.B6 125.98,40.34 125.98,40.3 | 125.98,40.3 125.37,40.3 R9.1
D-
  Top 0.254: R8.1 J3.B7 130.09,38.85 130.4,39.17 130.4,39.57 130.13,39.85 J3.A7
DCLK  (via drill 0.35)  (1 unrouted)
  Top 0.3: R26.2 84.71,52.63 C17.2 86.16,51.35 v86.22,51.29 | v88.32,51.26 88.03,50.97 88.03,47.91
  Bottom 0.3: v88.32,51.26 88.3,51.29 v86.22,51.29
DTR  (via drill 0.5)
  Top 0.5: R75.2 v124.56,50.93 124.56,51.98 Q10.2 | v124.9,62.94 124.89,62.93 U6.13
  Bottom 0.5: v124.9,62.94 124.98,62.87 124.98,51.35 v124.56,50.93
ESP32_RESET  (via drill 0.35)  (1 unrouted)
  Top 0.152: 131.84,54.36 K4.2
  Top 0.254: K4.2 128.81,57.39 R18.2 128.81,67.35 127.84,68.32 v118.85,68.32 111.56,75.61 | U2.3 10.34,29.9 11.57,28.66 v11.57,28.58 | R5.1 48.63,36.57 48.63,29.58 v48.7,29.51
  Top 0.3: v10.28,42.89 10.28,30.59 U2.3 | 111.56,75.61 22.88,75.61 10.22,62.95 v10.22,54.92 | v85.29,56.81 84.74,57.37 R54.2
  Top 0.5: Q9.3 131.65,54.13 K4.2
  Bottom 0.254: v48.7,29.51 48.76,29.56 48.76,28.55 46.1,25.89 14.26,25.89 v11.57,28.58
  Bottom 0.3: v10.28,42.89 10.26,42.91 10.26,54.88 v10.22,54.92 | v118.85,68.32 118.85,59.13 117.07,57.35 113.41,57.35 110.72,60.05 88.53,60.05 v85.29,56.81
GND  (via drill 0.35, 3.2 pad 5.2)
  Top 1: v8.78,51.7 7.8,50.72 U2.40 7.8,45.62 8.1,45.31 | 7.9,33.3 7.8,33.2 U2.1 7.8,27.87 8.38,27.28 | J3.P$7 J3.P$9 | J3.P$6 J3.P$8 | K4.1 129.51,47.99
  other vias: 133.76,76.43 3.56,76.43 3.56,3.51 133.77,3.51 91.94,51.05 75.83,61.17 127.55,63.94 105.27,36.54 52.66,15.32 115.13,75.23 22.78,50.56 69.93,52.84 100.23,3.6 102.09,62.83 82.26,76.87 13.54,61.26 95.03,55.53 84.81,22.88 55.44,71.06 126.16,42.36 29.99,69.34 11.86,16 106.31,76.89 46.21,63.53 41.89,22.63 70.64,28.3 99.75,37.99 15.96,6.21 9.02,17.25 105.28,31.9 26.95,49.35 26.55,9.16 89.19,70.73 126.29,45.83 105.56,57.73 85.13,3.28 100.22,77.11 113.64,51.41 89.66,51.11 14.83,24.02 127.49,44.22 74.87,22.63 91.05,70.7 88.14,77.08 114.28,47.1 111.06,30.42 92.38,22.66 27.42,76.63 115.5,76.73 93.36,51.02 74.49,52.64 34.01,71.43 30.32,63.34 75.45,3.24 93.31,77.07 33.11,52.96 108.52,40.45 47.7,22.29 33.95,76.64 88.45,56.13 123.09,44.3 77.17,62.27 29.08,58.31 57.95,22.06 110.73,24.44 122.39,72.44 93.61,34.54 65.69,77.18 100.45,22.71 13.86,44 39.69,76.88 33.38,27.23 72.42,61.19 112.12,41.46 105.72,56.39 8.99,23.53 90.75,51.14 102.19,43.77 29.54,53.1 126.99,21.7 8.81,54.11 51.76,29.01 52.41,22.04 74.21,61.16 128.38,31.53 116.05,68.32 128.34,45.89 15.31,65.47 24.68,22.7 47.45,18.59 101.39,40.86 38.52,19.47 99.99,34.61 75.62,28.3 34.05,24.55 70.85,22.76 13.25,69.49 11.72,23.83 26.56,6.98 17.2,22.79 125.98,65.22 33.93,21.79 20.61,68.93 41.48,63.52 38.01,24.77 59.82,76.85 28.41,21.77 80.56,34.59 79.25,28.46 59.7,62.46 112.05,42.9 114.38,45.92 8.63,33.26 8.63,36.36 8.68,39.53 8.63,43.14 8.7,45.96 95.69,58.46 97.97,55.74 99.4,55.82 77.09,55.16 75.5,55.37 51.55,77.23 109.2,41.11 99.88,54.5 94.45,58.46 14.07,41.42 47.98,13.92 11.75,43.32 63.94,29.18 11.74,41.66 9.03,20.4 12.84,20.06 8.89,57.27 128.26,23.11 8.95,60.64 128.32,24.82 12.46,59.38 53.95,27.85 9.15,26.17 108.82,43.06 31.12,31.4 112.87,53.77 15.53,15.84 64.21,28.3 62.91,62.37 108.89,38.82 14.95,11.22 126.95,27.8 14.94,9.21 104.01,15.36 39.66,3.43 51.14,3.16 31.92,3.32 69.07,34.54 111.94,18.81 74.67,34.57 85.33,64.74 61.72,22.22 16.63,72 67.77,31.34 80.95,70.56 31.9,71.11 107.26,53.37 114.64,67.51 93.62,64.68 105.58,59.27 84.28,70.75 125.09,44.28 16.77,76.23 126.09,73.88 122.99,46.32 128.02,59.28 128.05,56.15 122.88,55.72 37.72,53.02 68.6,71.14 36.57,27.27 60.33,3.17 51.11,63.48 86.37,34.58 28.39,11.11 44.85,27.32 56.86,27.85 121.88,38.55 126.86,3.95 127.58,24.23 103.55,8.82 122.37,75.86 110.35,77.06 116.21,59.65 112.53,57.04 112.68,55.47 10.53,76.86 10.33,66.66 127.53,30.09 105.42,41.18 128.43,33.52 125.85,33.24 127.25,32.39 125.91,31.53 127.96,35.07 126.4,11.92 126.9,6.85 26.96,60.02 22.07,52.56 23.08,55.63 89.34,61.3 128.3,76.07 34.77,15.73 36.39,30.01 30.44,29.79 34.98,29.79 26.58,29.79 29.77,13.24 29.95,16.86 11.85,45.01 114.63,18.73 104.98,22.56 96.88,22.74 118.15,51.3 113.3,52.43 116.05,51.39 14.72,50.56 18.08,50.64 16.87,52.03 25.4,62.01 110.51,62.6 105.76,72.58 67.04,27.3
  pour Bottom: 8.19,78.05 129.11,78.05 129.11,1.84 8.19,1.84
  pour Top (rank 4): -0.01,79.91 137.25,79.91 137.25,-0.06 -0.09,-0.06 -0.09,14.73 7.22,14.73 7.22,64.54 -0.01,64.54
I2S_BCLK
  Top 0.3: U11.3 20.08,23.15 R19.1
I2S_CTRL
  Top 0.3: U11.1 22.62,23.15 22.62,25.36 R22.1
I2S_SDIN
  Top 0.3: U11.4 18.81,23.15 18.81,25.54 R4.1
INTE
  Top 0.254: IC1.7 52.62,30.74 52.18,30.74 49.83,28.4 46.25,28.4 44.83,29.82 J6.9
IO0_BOOT_CLK  (via drill 0.35)
  Top 0.254: v43.79,69.33 42.36,69.33 24.31,51.28 U2.27 26.69,50.91 v28.2,50.91 | v120.23,69.36 129.53,69.36 131.9,66.99 K1.2
  Top 0.3: v80.87,51.3 81.03,51.3 83.87,54.13 R26.1
  Top 0.5: Q10.3 126.16,56.57 127.08,57.49 127.08,61.94 v127.25,62.1 | v130.28,62.86 130.36,62.94 132.29,62.94 132.28,62.95 K1.2
  Bottom 0.254: v120.23,69.36 v120.23,69.35 43.81,69.35 v43.79,69.33
  Bottom 0.3: v80.87,51.3 80.73,51.16 28.45,51.16 v28.2,50.91
  Bottom 0.5: v127.25,62.1 128.01,62.86 v130.28,62.86
IO1_B7  (via drill 0.35)
  Top 0.254: JP1.P$13 89.03,45.34 88.94,45.25 v88.79,45.25 | U2.39 9.07,47.14 10.16,46.05 14.2,46.05 v16.19,44.07
  Bottom 0.254: v88.79,45.25 87.1,43.56 16.69,43.56 v16.19,44.07 | v16.19,44.07
IO2_LCD_BL_CTR  (via drill 0.35)  (1 unrouted)
  Top 0.254: v22.31,64.72 10.34,52.74 U2.38 | 98.59,64.11 98.69,64.21 100.28,64.21 v100.48,64 101.07,63.41 101.08,63.41 101.08,61.03 99.81,59.75 U4.4
  Bottom 0.254: v22.31,64.72 29.47,64.72 30.3,65.55 98.94,65.55 v100.48,64
IO3_B4  (via drill 0.35)  (1 unrouted)
  Top 0.3: 90.52,48.14 90.52,37.24 v90.04,36.76 | U2.15 26.85,32.53 v31.39,37.07
  Bottom 0.3: v90.04,36.76 89.79,37.01 31.44,37.01 v31.39,37.07
IO4_G7  (via drill 0.35)
  Top 0.254: v92.76,45.72 93.03,45.99 JP1.P$21
  Top 0.3: U2.4 11.61,32.31 v12.37,33.07
  Bottom 0.3: v12.37,33.07 13.55,34.25 13.55,39.45 17.12,43.03 91,43.03 92.76,44.79 v92.76,45.72
IO5_G2  (via drill 0.35)
  Top 0.254: JP1.P$26 95.53,40.05 v95.48,40
  Top 0.3: U2.5 12.88,32.25 14.14,33.51 v14.98,33.51
  Bottom 0.3: v14.98,33.51 14.98,35.94 18.45,39.42 94.89,39.42 v95.48,40
IO6_G3  (via drill 0.35)
  Top 0.254: JP1.P$25 95.03,41.31 v94.67,40.95
  Top 0.3: U2.6 14.15,32.03 v14.19,32.07
  Bottom 0.3: v14.19,32.07 14.19,36.02 18.11,39.94 93.66,39.94 v94.67,40.95
IO7_G4  (via drill 0.35)
  Top 0.254: JP1.P$24 94.53,42.4 v93.99,41.86
  Top 0.3: v16.29,39.22 16.29,33.59 15.42,32.72 U2.7
  Bottom 0.3: v93.99,41.86 92.81,40.68 17.84,40.68 16.38,39.22 v16.29,39.22
IO8_B3  (via drill 0.35)
  Top 0.3: v21.74,32.27 21.77,32.25 U2.12 | JP1.P$17 91.03,36.61 v91.08,36.61
  Bottom 0.3: v91.08,36.61 90.48,36 22.7,36 21.74,35.05 v21.74,32.27
IO9_B6  (via drill 0.35)  (1 unrouted)
  Top 0.3: U2.17 26.44,35.08 v29.03,37.67 | v89.1,38.62 89.1,38.71 89.52,39.12 89.52,47.94
  Bottom 0.3: v89.1,38.62 88.96,38.76 30.12,38.76 v29.03,37.67
IO10_TF_CS  (via drill 0.35)
  Top 0.254: U2.18 26.54,36.35 29.18,39 31.13,39 32.61,37.52 v32.61,32.51
  Top 0.3: SD1.2 116.63,15.56 116.63,17.53 v117.55,18.45 117.55,20.1 R67.2
  Bottom 0.254: v117.55,18.45 116.96,18.45 115.21,16.7 108.2,16.7 105.52,19.38 67.54,19.38 54.71,32.21 32.92,32.21 v32.61,32.51
IO11_TF_SPI_MOSI/TP_DIN  (via drill 0.35)  (1 unrouted)
  Top 0.254: U2.19 26.7,37.62 28.61,39.53 31.67,39.53 33.38,37.82 33.38,33.3 v33.66,33.02
  Top 0.3: R23.2 116.15,18.73 v115.62,18.19 115.62,15.88 115.85,15.65
  Bottom 0.254: v115.62,18.19 114.63,17.2 108.53,17.2 105.63,20.1 67.91,20.1 54.99,33.02 v33.66,33.02
IO12_TF_CLK/TP_CLK  (via drill 0.35)
  Top 0.254: U2.20 26.98,38.89 28.24,40.15 31.91,40.15 34.21,37.85 34.21,34.11 v34.52,33.81
  Top 0.3: SD1.5 113.54,15.52 v113.54,17.95
  Bottom 0.254: v113.54,17.95 108.75,17.95 105.89,20.81 68.54,20.81 55.55,33.8 v34.52,33.8 v34.52,33.81
IO13_TF_SPI_MISO/TP_OUT  (via drill 0.35)
  Top 0.254: U2.21 27.4,40.16 28.06,40.82 32.23,40.82 34.85,38.2 34.85,35.08 v35.13,34.8
  Top 0.3: R24.2 110.28,19.02 v110.33,19.02 110.44,19.02 111.26,18.21 SD1.7
  Bottom 0.254: v110.33,19.02 108.81,19.02 106.45,21.39 69.14,21.39 55.73,34.8 v35.13,34.8
IO14_R7  (via drill 0.35)  (1 unrouted)
  Top 0.3: U2.22 25.89,41.35 26.14,41.35 26.2,41.4 27.59,41.4 v32.84,46.65 | 97.01,47.96 97.01,43.27 v97.03,43.26
  Bottom 0.254: 93.45,46.73 93.4,46.78 32.98,46.78 v32.84,46.65
  Bottom 0.3: v97.03,43.26 96.93,43.26 93.45,46.73 | v32.84,46.65 32.93,46.73
IO15_G5  (via drill 0.35)
  Top 0.254: v93.8,43.07 94.03,43.07 JP1.P$23
  Top 0.3: U2.8 16.71,30.56 16.71,32.08 17.12,32.48 v17.12,41.22
  Bottom 0.3: v93.8,43.07 92.03,41.3 17.2,41.3 v17.12,41.22
IO16_G6  (via drill 0.35)
  Top 0.254: JP1.P$22 93.53,44.05 v93.29,44.05
  Top 0.3: U2.9 17.96,32.04 18.12,32.21 18.12,42.15 v18.08,42.2
  Bottom 0.3: v18.08,42.2 18.22,42.34 91.67,42.34 93.29,43.96 v93.29,44.05
IO17_I2S_SDIN
  Top 0.254: U2.10 19.23,27.79 R4.2
IO18_I2S_LRCLK  (1 unrouted)
  Top 0.254: U2.11 20.74,30.29 20.74,27.96 21.46,27.24
IO19_I2C_SDA  (via drill 0.35)  (1 unrouted)
  Top 0.254: 37.39,28.92 v37.36,28.89 23.56,28.89 23.04,29.41 U2.13 23.04,46.43 v22.63,46.84 | R1.1 42.83,36.73 J6.5 42.83,30.02 v42.66,29.85 | v24.13,67.77 24.13,70.41 24.64,70.92 | J8.2 24.36,71.93 26.61,74.18 106.92,74.18 109.65,71.45 109.65,68.86 109.64,68.87 J4.7 | IC1.2 51.1,33.98 50.75,33.63 v50.75,30.94
  Bottom 0.254: v37.36,28.89 38.24,29.77 42.59,29.77 v42.66,29.85 43.26,30.45 50.26,30.45 v50.75,30.94 | v22.63,46.84 22.63,46.91 18.9,50.65 18.9,64.59 22.07,67.77 v24.13,67.77
IO20_I2C_SCL  (via drill 0.35)
  Top 0.254: J6.3 41.83,36.8 R7.1 40.56,36.98 35.2,31.62 v34.87,31.29 34.11,30.53 U2.14 23.88,30.96 v23.88,46.79 | v22.02,66.17 22.35,66.5 J8.1 22.36,72.68 24.47,74.79 110,74.79 112.18,72.61 J4.8 | v49.78,31.17 49.78,33.4 50.95,34.57 52.57,34.57 IC1.1
  Bottom 0.254: v23.88,46.79 19.99,50.67 19.99,64.15 22.01,66.17 v22.02,66.17 | v34.87,31.29 34.92,31.25 49.4,31.25 49.48,31.17 v49.78,31.17
IO21_R6  (via drill 0.35)  (1 unrouted)
  Top 0.3: U2.23 27.32,42.7 v32,47.38 | 97.52,47.92 97.52,44.21 v97.76,43.97
  Bottom 0.3: v97.76,43.97 94.11,47.62 32.16,47.62 32,47.46 v32,47.38
IO38_D  (via drill 0.35)  (1 unrouted)
  Top 0.254: J2.1 46.9,70.35 44.35,70.35 v43.51,71.19 36.77,71.19 19.23,53.64 U2.31 | 102.07,70.79 99.13,73.72 54.55,73.72 v53.65,72.82
  Bottom 0.254: v43.51,71.19 45.39,73.07 53.4,73.07 v53.65,72.82
IO39_HSYNC  (via drill 0.35)
  Top 0.254: JP1.P$9 87.03,45.02 v87,44.99 | U2.32 17.96,47.12 v19.98,45.09
  Bottom 0.254: v87,44.99 86.91,45.07 20,45.07 v19.98,45.09
IO40_DE  (via drill 0.35)
  Top 0.254: JP1.P$7 86.03,47.8 86.03,46.1 v85.73,45.8 | U2.33 16.69,47 v17.73,45.95
  Bottom 0.254: v17.73,45.95 17.82,45.87 85.66,45.87 v85.73,45.8
IO41_VSYNC  (via drill 0.35)
  Top 0.254: v85.51,44.28 85.51,44.54 86.53,45.56 JP1.P$8 | U2.34 15.42,47.16 18.13,44.45 v19.05,44.45
  Bottom 0.254: v85.51,44.28 v85.5,44.28 19.22,44.28 v19.05,44.45
IO42-I2S_BCLK  (via drill 0.35)
  Top 0.254: U2.35 14.15,47.45 17.97,43.62 20.24,43.62 20.91,42.95 v20.91,38.58 | v19.98,28.84 19.99,28.83 19.99,27.3 R19.2
  Bottom 0.254: v20.91,38.58 20.99,38.5 20.99,29.85 v19.98,28.84
IO45_R3  (via drill 0.35)  (1 unrouted)
  Top 0.254: v29.76,48.99 29.79,48.97 31.04,48.97 R31.2
  Top 0.3: U2.26 27.3,46.53 v29.76,48.99 | v98.92,49.6 99.04,49.49 99.04,47.94
  Bottom 0.3: v98.92,49.6 98.59,49.94 30.71,49.94 v29.76,48.99
IO46_B5  (via drill 0.35)  (1 unrouted)
  Top 0.3: U2.16 26.63,33.81 30.33,37.52 v30.33,37.68 | v89.75,37.75 89.75,37.83 90.02,38.11 90.02,48.17
  Bottom 0.3: v30.33,37.68 30.51,37.86 89.64,37.86 v89.75,37.75
IO47_R5  (via drill 0.35)  (1 unrouted)
  Top 0.3: v30.69,47.41 27.25,43.97 U2.24 | 98.03,47.95 98.03,45.09 v98.33,44.79
  Bottom 0.3: v98.33,44.79 94.86,48.26 31.53,48.26 v30.69,47.41
IO48_R4  (via drill 0.35)  (1 unrouted)
  Top 0.3: U2.25 26.06,45.49 27.31,45.49 v29.72,47.9 | 98.54,48.05 98.54,46.08 v98.83,45.79
  Bottom 0.3: v98.83,45.79 95.58,49.03 30.85,49.03 v29.72,47.9
LCD_LEDA  (1 unrouted)
  Top 0.3: JP1.P$39 102.03,53.2 102.03,54.06 | 102.48,53.17 102.11,53.55
  Top 0.5: 102.03,54.06 100.53,55.56 100.53,56.71 101.6,57.79 C21.2 102.76,59.44 C19.2 100.82,59.63 99.57,58.37 98.43,58.37 97.77,59.04 97.77,59.72 U4.5 | D6.2 102.02,53.38
  Top 1: D6.2 102.2,53.2 102.03,53.2
  pour Top: 101.13,51.94 103.31,51.94 102.39,51.02 102.39,49.59 102.18,49.38 101.55,50.01 101.55,51.18 101.13,51.6
LCD_LEDK  (via drill 0.35)
  Top 0.3: 102.53,48.31 104.87,50.65
  Top 0.5: v99.62,57.1 99.57,57.15 U4.3 | R29.1 101.54,56.36 v101.53,56.35
  Bottom 0.5: v101.53,56.35 100.77,57.1 v99.62,57.1
  pour Top: 102.39,56.9 103.14,56.9 103.48,56.56 103.48,55.97 105.08,54.38 105.08,49.36 102.87,47.15 102.56,47.15 102.39,47.32 102.39,48.66 103.82,50.09 103.82,54.8 102.81,55.8 102.39,55.8 102.22,55.97 102.22,56.73
LRCLK
  Top 0.3: U11.2 21.35,23.15 21.35,25.54 R12.1
N$1
  Top 0.3: R3.1 132.03,30.28 LED1.+
N$2
  Top 0.5: U11.5 18.89,14.82 C27.2
N$3
  Top 0.5: C14.1 22.94,13.22 C28.1 21.83,12.12 J5.P$2
N$7
  Top 0.3: JP1.P$10 87.53,52.53 R25.2
N$8
  Top 0.5: U11.8 22.7,14.96 C28.2
N$11
  Top 0.3: J3.A5 125.93,38.35 R13.2
N$13  (1 unrouted)
  Top 0.8: U1.3 111.4,44.81
N$15
  Top 0.5: C16.1 17.39,13.21 C27.1 19.83,12.18 J5.P$1
N$16  (1 unrouted)
  Top 0.8: L5.2 92.06,57.15 U4.1 96.79,52.67 96.8,52.66
N$17
  Top 0.3: J3.B5 125.73,41.34 R14.1
N$20
  Top 0.5: R21.1 116.94,48.44 117.01,48.36 R20.2 116.92,48.38 116.92,47.8 U1.5
N$21  (via drill 0.5)
  Top 0.5: v118.47,23.22 119.29,24.04 R44.2
  Top 0.8: Q3.1 116.14,25.51 v116.23,25.6 | R44.2 R2.1
  Bottom 0.8: v118.47,23.22 118.47,23.37 v116.23,25.6
N$22
  Top 0.8: U26.5 112.76,35.03 R6.1
N$23  (1 unrouted)
  Top 0.8: Q5.1 98.69,62.27 R11.1
N$27
  Top 0.8: Q6.3 81.24,63.4 R48.2 81.56,63.09 Q4.1
N$32
  Top 0.5: R75.1 126.05,50.04 126.05,51.1 Q9.1
N$33
  Top 0.8: R55.2 R54.1 83.09,57.84 Q6.1
N$36
  Top 0.8: Q30.1 89.19,62.66 R172.2 92.44,62.66 Q5.3
N$38
  Top 0.5: R74.1 122.77,49.36 Q10.1
N$40
  Top 0.3: R72.2 115.29,65.55 118.48,65.55 U6.2
N$41
  Top 0.254: P1.P$1 61.39,28.83 61.39,31.34 60.04,32.68 IC1.13
N$42
  Top 0.3: U6.3 115.27,64.2 R71.2
N$43
  Top 0.254: IC1.11 59.09,31.38 60.05,30.43 P5.P$1
N$47
  Top 0.3: SD1.1 117.83,15.46 117.83,15.69 119.12,16.97 R16.2
N$48
  Top 0.3: SD1.8 110.16,17.07 108.89,18.35 R17.2
N$66
  Top 0.254: IC1.15 58.67,33.98 61.37,33.98 R61.1 62.41,32.94 C22.1
RTS  (via drill 0.5)
  Top 0.5: R74.2 127.59,49.25 v127.59,50.76 127.57,50.79 127.95,51.17 Q9.2 | v125.99,63.95 125.74,64.2 U6.14
  Bottom 0.5: v127.59,50.76 125.91,52.44 125.91,63.87 v125.99,63.95
TFT-3V3
  Top 0.3: C3.1 93.6,54.13 93.88,54.13 94.54,53.47 94.54,51.93 95.74,50.72 99.61,50.72 101.03,49.31 JP1.P$37
  Top 0.8: Q4.3 81.49,58.72 R56.2 81.49,56.91 82.58,55.83 87.02,55.83 87.6,55.25 R25.1 C23.2 C15.2 C10.2 93.6,54.13
TP-RESET
  Top 0.254: R5.2 45.03,36.9 43.83,35.71 J6.7 43.85,34.83 43.85,29.55 45.57,27.84 52.17,27.84 54.43,30.1 54.43,30.81 53.86,31.38 IC1.6
UART0_RXD0  (via drill 0.35)
  Top 0.254: U2.36 12.88,51.47 v27.14,65.74 v27.15,65.74 | R72.1 113.52,66.13 113.29,65.9 112.09,65.9 v111.85,66.14
  Top 0.3: J10.1 71.36,70.12 v71.36,67.97
  Bottom 0.254: v27.15,65.74 29.42,68 71.33,68 v71.36,67.97 71.4,68.01 109.98,68.01 v111.85,66.14
UART0_TXD0  (via drill 0.35)
  Top 0.254: v29.87,66.8 26.04,66.8 11.61,52.17 U2.37 | v111.73,64.52 111.75,64.49 113.49,64.49 R71.1 | v73.36,66.79 73.36,70.12 J10.2
  Bottom 0.254: v29.87,66.8 29.93,66.86 73.28,66.86 v73.36,66.79 109.45,66.79 v111.73,64.52
USB_D+
  Top 0.254: R9.2 121.57,42.58 121.57,60.16 120.06,61.66 U6.5
USB_D-  (1 unrouted)
  Top 0.254: R8.2 120.65,41.7 120.65,57.74 120.65,59.45 119.69,60.41 118.67,60.41
VBUS  (via drill 0.35)  (5 unrouted)
  Top 0.3: R2.2 121.65,25.57 121.64,25.58 v122.76,25.58 | 119.63,34.02 121.66,34.02 122.71,32.97 v122.78,32.97
  Top 0.6: 129.37,37.2 127.4,37.2 | 129.09,42 130.01,42 131.37,40.64 131.37,38.56 130.01,37.2 129.09,37.2
  Top 0.8: U26.4 116.3,33.59 C50.1 117.99,33.55 C49.2 119.15,33.53 119.63,34.02 120.32,34.7 120.32,35.69 | 120.32,35.69 120.32,36.79 118.85,38.26 D3.1 | 120.32,35.69 125.88,35.69 127.4,37.2
  Bottom 0.3: v122.78,32.97 122.76,32.94 v122.76,25.58
VDD  (via drill 0.5)
  Top 0.8: R10.2 R45.2 C24.1 27.15,15.22 C25.1 25.65,15.11 v25.61,15.15 | v20.32,15.23 20.16,15.39 U11.6
  Bottom 0.8: v25.61,15.15 20.4,15.15 v20.32,15.23
VIN  (via drill 0.5)  (1 unrouted)
  Top 0.5: U1.1 116.11,46.71 U1.4
  Top 0.8: Q30.2 88.95,64.43 88.99,64.39 90.67,64.39 R172.1 91.13,64.44 v92.07,64.44 | 118.86,44.81 119.44,45.39 119.44,53.13 113.54,59.04 v113.54,59.06 | R45.1 33.54,18.22 39.6,24.28 105.15,24.28 v105.22,24.21 | U1.4 118.01,44.66 116.87,43.51 116.87,43.1 C42.2 116.91,42.99 C6.2 116.38,41.33 D3.2 111,38.26 108.78,36.04 v108.78,27.15 109.38,27.75 D5.C 113.46,27.14 113.46,24.69 114.64,23.51 Q3.2
  Top 1: U1.4 118.86,44.81
  Bottom 0.8: v113.54,59.06 111.11,61.49 94.96,61.49 92.07,64.39 v92.07,64.44 | 105.13,24.14 108.1,24.14 108.78,24.83 v108.78,27.15
VIN2  (1 unrouted)
  Top 0.8: U4.6 91.84,59.75 L5.1 91.63,59.54 C18.2 86.5,59.58 Q30.3

### Text on the board
tPlace: J4
tNames: GND | 3V3 | NC | IO38 | GND | 3V3 | IO19-SDA | IO20-SCL | IO20-SCL | IO19-SDA | 3V3 | GND | IO38 | NC | 3V3 | GND | IO44-RX0 | IO43-TX0 | 3V3 | GND | GND | 5V | 40 | 1 | V3.0 | 1 | 10 | - | I2S-CTRL | IO18-I2S-LRCLK | IO42-I2S-BCLK | IO17-I2S-SDIN | + | VON- | VOP+
tStop: ESP32 Display-5 Inch | SKU:DIS07050H